# EAGLE design COMP (EAGLE 8.2.2)

## Sheet 1 of 3
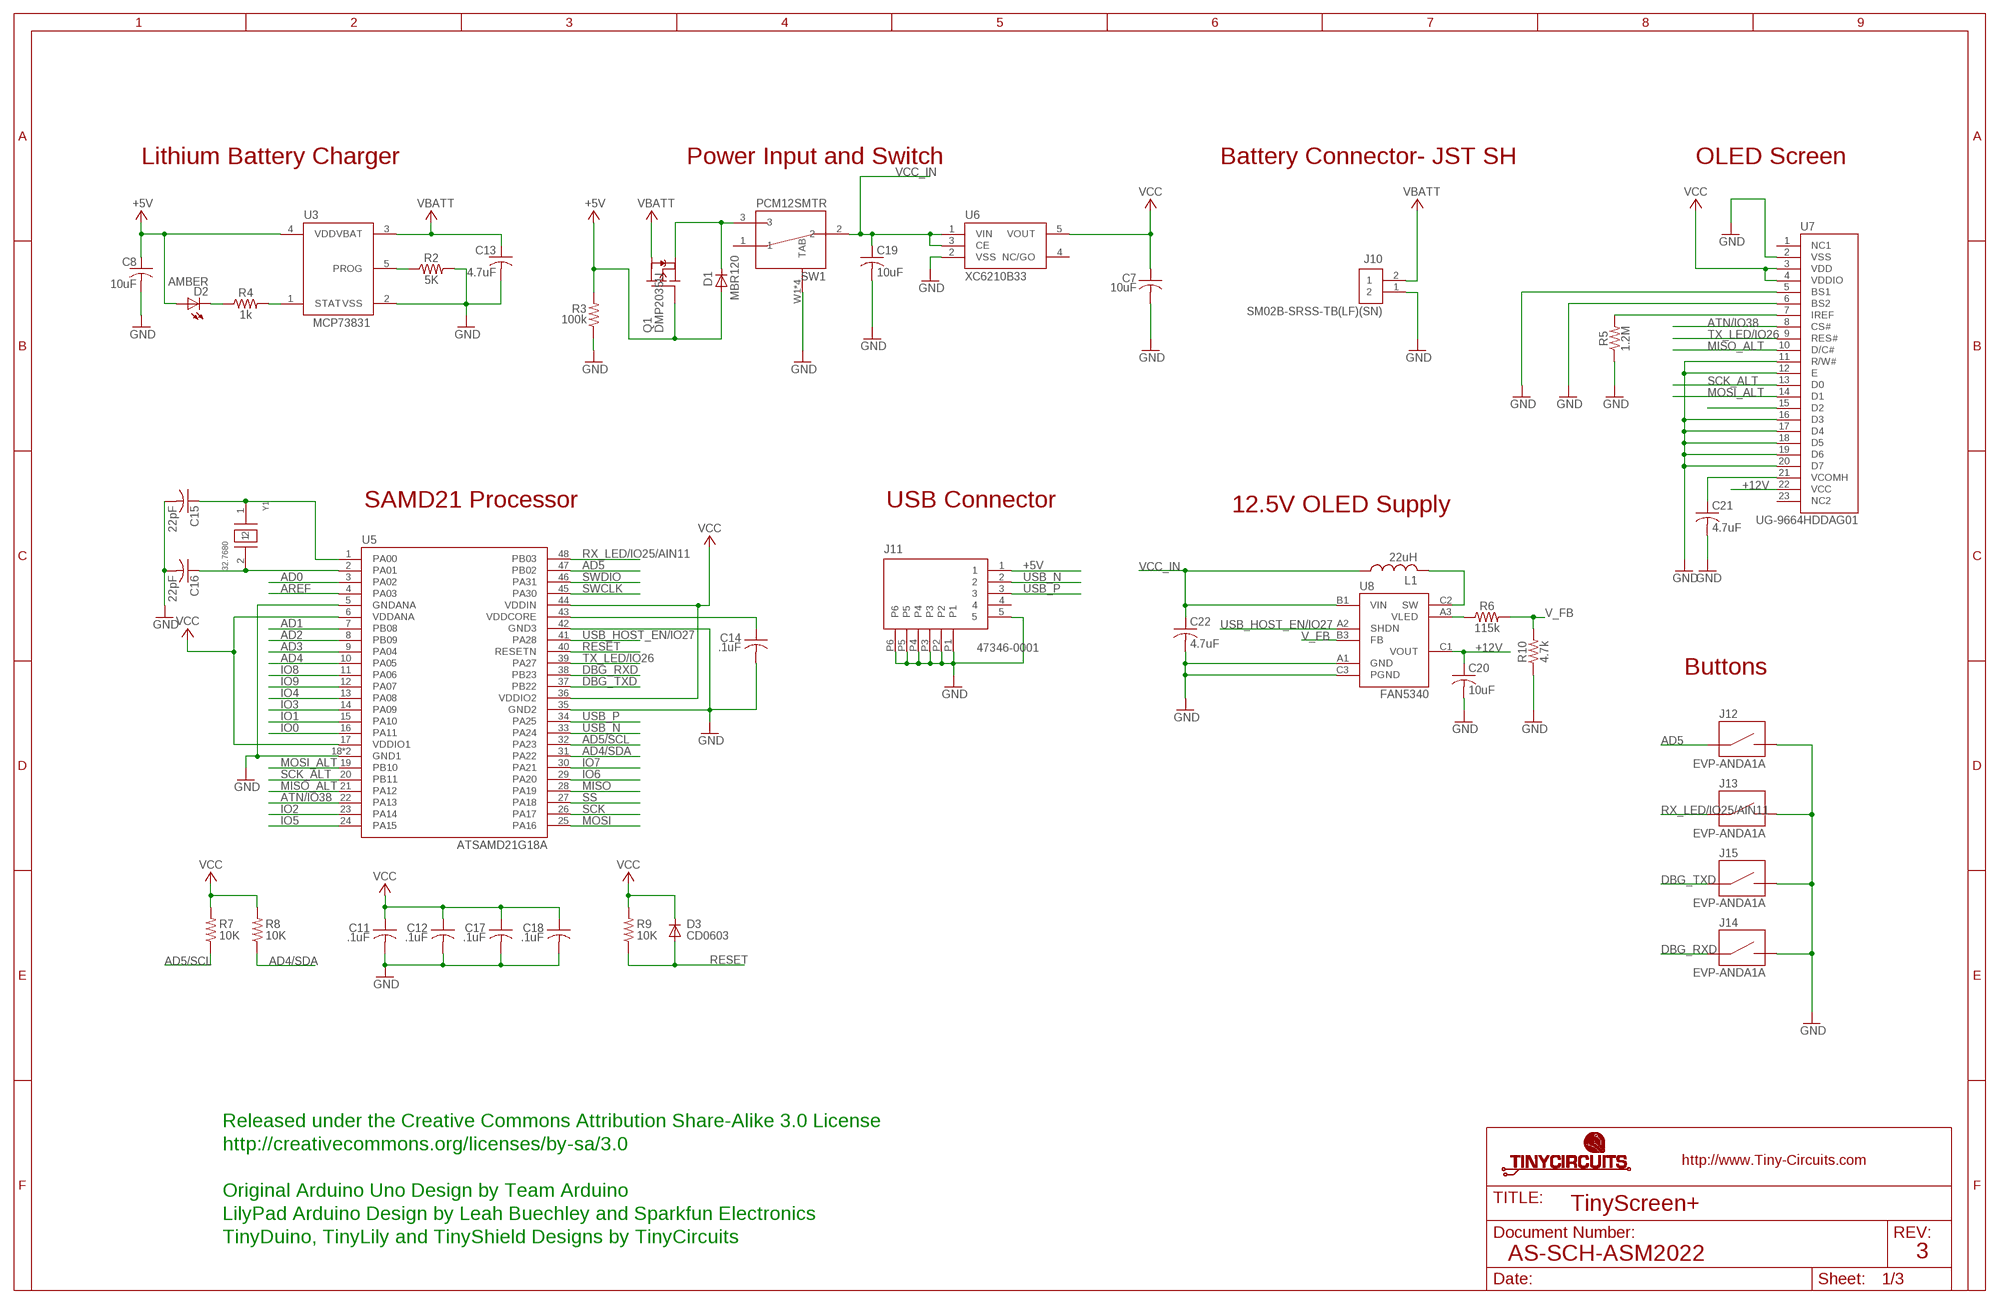
[diagram p0: schematic, sheet 1]

### Parts
C7  10uF  AS-ITM-00002  [C0603]
C8  10uF  AS-ITM-00002  [C0603]
C11  .1uF  AS-ITM-00008  [C0402]
C12  .1uF  AS-ITM-00008  [C0402]
C13  4.7uF  AS-ITM-00088  [C0603]
C14  .1uF  AS-ITM-00008  [C0402]
C15  22pF  AS-ITM-00211  [C0402]
C16  22pF  AS-ITM-00211  [C0402]
C17  .1uF  AS-ITM-00008  [C0402]
C18  .1uF  AS-ITM-00008  [C0402]
C19  10uF  AS-ITM-00045  [C0805]
C20  10uF  AS-ITM-00045  [C0805]
C21  4.7uF  AS-ITM-00232  [1206_CAP_TANT]
C22  4.7uF  AS-ITM-00242  [C0402]
D1  MBR120  AS-ITM-00111  [SOD-123FL]
D2  AMBER  AS-ITM-00026  [LNJ_LED]
D3  CD0603  AS-ITM-00009  [0603]
J10  SM02B-SRSS-TB(LF)(SN)  AS-ITM-00231  [JST_SH_2X1]
J11  47346-0001  AS-ITM-00021  [MICRO_USB]
J12  EVP-ANDA1A  AS-ITM-00236  [PTS840GKP]
J13  EVP-ANDA1A  AS-ITM-00236  [PTS840GKP]
J14  EVP-ANDA1A  AS-ITM-00236  [PTS840GKP]
J15  EVP-ANDA1A  AS-ITM-00236  [PTS840GKP]
L1  22uH  AS-ITM-00281  [R0805]
Q1  DMP2035U  AS-ITM-00024  [SOT23]
R2  5K  AS-ITM-00289  [0402]
R3  100k  AS-ITM-00004  [0402]
R4  1k  AS-ITM-00003  [0402]
R5  1.2M  AS-ITM-00280  [0402]
R6  115k  AS-ITM-00179  [0402]
R7  10K  AS-ITM-00032  [0402]
R8  10K  AS-ITM-00032  [0402]
R9  10K  AS-ITM-00032  [0402]
R10  4.7k  AS-ITM-00167  [0402]
SW1  PCM12SMTR  AS-ITM-00220  [PCM12SMTR]
U3  MCP73831  AS-ITM-00136  [SOT-23]
U5  ATSAMD21G18A  AS-ITM-00273  [QFN48]
U6  XC6210B33  AS-ITM-00046  [SOT-25]
U7  UG-9664HDDAG01  AS-ITM-00158  [OLED_DISPLAY]
U8  FAN5340  AS-ITM-00277  [WLCSP8_1_57X1_57]
Y1  32.7680  AS-ITM-00279  [ABS06]

### Nets
+5V: C8.1 D1.A D2.A J11.1 Q1.B(G) R3.2 U3.4(VDD)
+12V: C20.1 U7.22(VCC) U8.C1(VOUT)
AD0: U5.3(PA02)
AD1: U5.7(PB08)
AD2: U5.8(PB09)
AD3: U5.9(PA04)
AD4: U5.10(PA05)
AD4/SDA: R8.1 U5.31(PA22) ; also sheet 2
AD5: J12.1 J12.2 U5.47(PB02)
AD5/SCL: R7.1 U5.32(PA23) ; also sheet 2
AREF: U5.4(PA03)
ATN/IO38: U5.22(PA13) U7.8(CS#)
DBG_RXD: J14.1 J14.2 U5.38(PB23)
DBG_TXD: J15.1 J15.2 U5.37(PB22)
GND: C7.2 C8.2 C11.2 C12.2 C13.2 C14.2 C15.2 C16.2 C17.2 C18.2 C19.2 C20.2 C21.2 C22.2 J10.1 J11.5 J11.P1 J11.P2 J11.P3 J11.P4 J11.P5 J11.P6 J12.3 J12.4 J13.3 J13.4 J14.3 J14.4 J15.3 J15.4 R2.2 R3.1 R5.1 R10.1 SW1.W1(TAB) SW1.W2(TAB) SW1.W3(TAB) SW1.W4(TAB) U3.2(VSS) U5.5(GNDANA) U5.18(GND1) U5.35(GND2) U5.42(GND3) U5.EXP(GND1) U6.2(VSS) U7.2(VSS) U7.5(BS1) U7.6(BS2) U7.11(R/W#) U7.12(E) U7.16(D3) U7.17(D4) U7.18(D5) U7.19(D6) U7.20(D7) U8.A1(GND) U8.C3(PGND) ; also sheet 2
IO0: U5.16(PA11)
IO1: U5.15(PA10)
IO2: U5.23(PA14)
IO3: U5.14(PA09)
IO4: U5.13(PA08)
IO5: U5.24(PA15)
IO6: U5.29(PA20)
IO7: U5.30(PA21)
IO8: U5.11(PA06)
IO9: U5.12(PA07)
MISO: U5.28(PA19)
MISO_ALT: U5.21(PA12) U7.10(D/C#)
MOSI: U5.25(PA16)
MOSI_ALT: U5.19(PB10) U7.14(D1)
N$3: D1.C Q1.E(S) SW1.3
N$4: C15.1 U5.1(PA00) Y1.1
N$5: D2.C R4.1
N$6: R2.1 U3.5(PROG)
N$7: R4.2 U3.1(STAT)
N$8: C16.1 U5.2(PA01) Y1.2
N$9: C14.1 U5.43(VDDCORE)
N$10: L1.2 U8.C2(SW)
N$11: R5.2 U7.7(IREF)
N$12: C21.1 U7.21(VCOMH)
N$13: R6.1 U8.A3(VLED)
N$15: U7.15(D2)
RESET: D3.A R9.1 U5.40(RESETN)
RX_LED/IO25/AIN11: J13.1 J13.2 U5.48(PB03)
SCK: U5.26(PA17)
SCK_ALT: U5.20(PB11) U7.13(D0)
SS: U5.27(PA18)
SWCLK: U5.45(PA30)
SWDIO: U5.46(PA31)
TX_LED/IO26: U5.39(PA27) U7.9(RES#)
USB_HOST_EN/IO27: U5.41(PA28) U8.A2(SHDN)
USB_N: J11.2 U5.33(PA24)
USB_P: J11.3 U5.34(PA25)
V_FB: R6.2 R10.2 U8.B3(FB)
VBATT: C13.1 J10.2 Q1.C(D) U3.3(VBAT)
VCC: C7.1 C11.1 C12.1 C17.1 C18.1 D3.C R7.2 R8.2 R9.2 U5.6(VDDANA) U5.17(VDDIO1) U5.36(VDDIO2) U5.44(VDDIN) U6.5(VOUT) U7.3(VDD) U7.4(VDDIO) ; also sheet 2
VCC_IN: C19.1 C22.1 L1.1 SW1.2 U6.1(VIN) U6.3(CE) U8.B1(VIN)
Unconnected: J11.4 SW1.1 U6.4(NC/GO) U7.1(NC1) U7.23(NC2)

### Notes on the sheet
- Lithium Battery Charger | Power Input and Switch | Battery Connector- JST SH | OLED Screen
- SAMD21 Processor | USB Connector | 12.5V OLED Supply
- Buttons
- Released under the Creative Commons Attribution Share-Alike 3.0 License
- http://creativecommons.org/licenses/by-sa/3.0
- Original Arduino Uno Design by Team Arduino
- TinyScreen+
- LilyPad Arduino Design by Leah Buechley and Sparkfun Electronics
- TinyDuino, TinyLily and TinyShield Designs by TinyCircuits
- AS-SCH-ASM2022 | 3

## Sheet 2 of 3
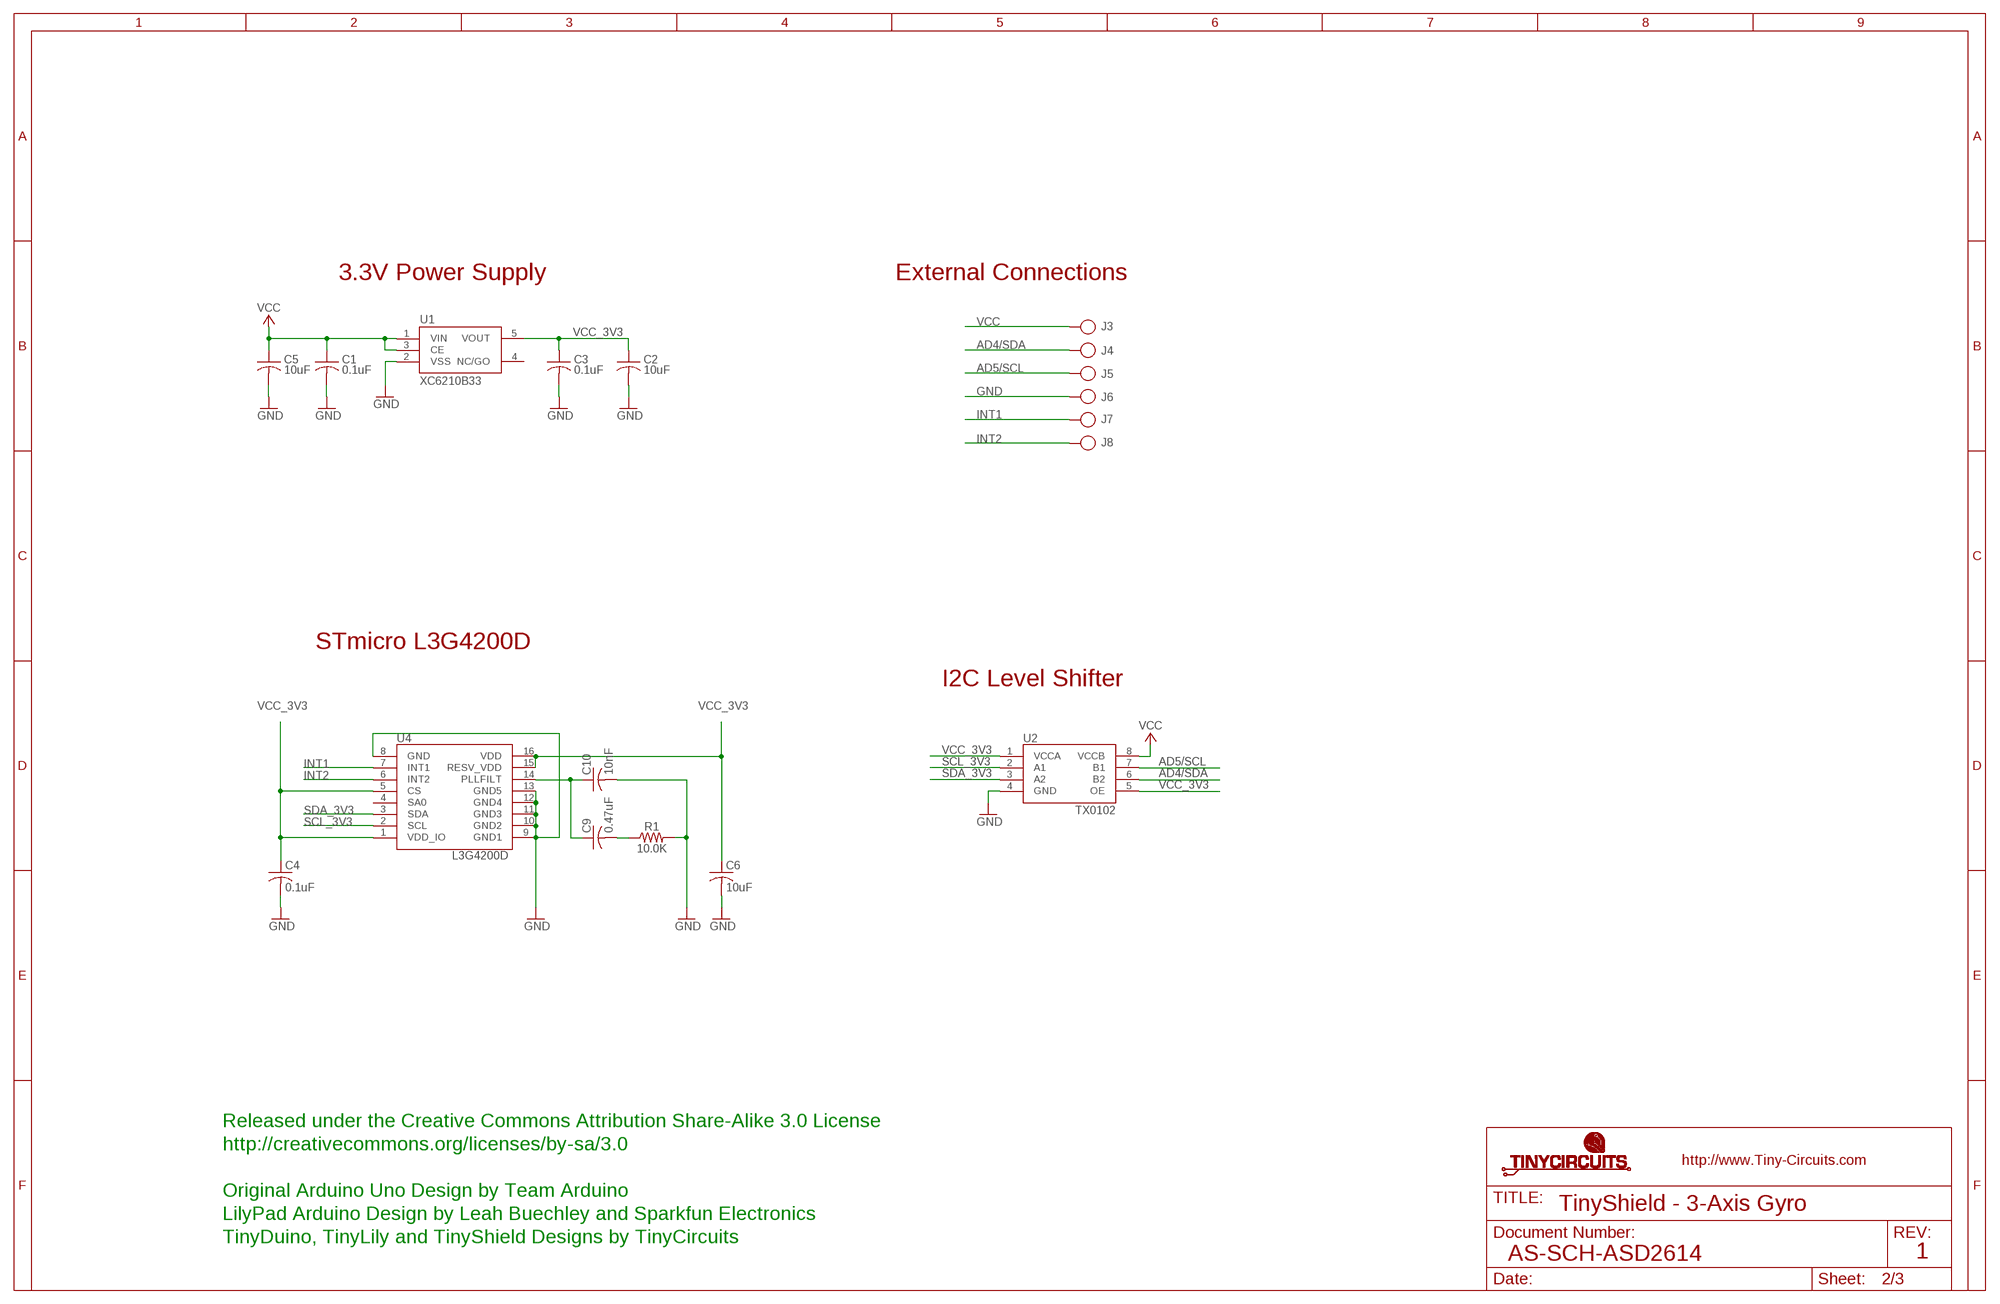
[diagram p1: schematic, sheet 2]

### Parts
C1  0.1uF  AS-ITM-00008  [C0402]
C2  10uF  AS-ITM-00045  [C0805]
C3  0.1uF  AS-ITM-00008  [C0402]
C4  0.1uF  AS-ITM-00008  [C0402]
C5  10uF  AS-ITM-00045  [C0805]
C6  10uF  AS-ITM-00002  [C0603]
C9  0.47uF  AS-ITM-00090  [C0402@1]
C10  10nF  AS-ITM-00084  [0402@1]
J3  PIN_1X.1"  [1X.1"]
J4  PIN_1X.1"  [1X.1"]
J5  PIN_1X.1"  [1X.1"]
J6  PIN_1X.1"  [1X.1"]
J7  PIN_1X.1"  [1X.1"]
J8  PIN_1X.1"  [1X.1"]
R1  10.0K  AS-ITM-00032  [0402]
U1  XC6210B33  AS-ITM-00046  [SOT-25]
U2  TX0102  AS-ITM-00073  [DQE(R-PX2SON-N8)]
U4  L3G4200D  AS-ITM-00089  [L3G4200D]

### Nets
AD4/SDA: J4.1 U2.6(B2) ; also sheet 1
AD5/SCL: J5.1 U2.7(B1) ; also sheet 1
GND: C1.2 C2.2 C3.2 C4.2 C5.2 C6.2 C10.2 J6.1 R1.2 U1.2(VSS) U2.4(GND) U4.8(GND) U4.9(GND1) U4.10(GND2) U4.11(GND3) U4.12(GND4) U4.13(GND5) ; also sheet 1
INT1: J7.1 U4.7(INT1)
INT2: J8.1 U4.6(INT2)
N$1: C9.2 R1.1
N$2: C9.1 C10.1 U4.14(PLLFILT)
SCL_3V3: U2.2(A1) U4.2(SCL)
SDA_3V3: U2.3(A2) U4.3(SDA)
VCC: C1.1 C5.1 J3.1 U1.1(VIN) U1.3(CE) U2.8(VCCB) ; also sheet 1
VCC_3V3: C2.1 C3.1 C4.1 C6.1 U1.5(VOUT) U2.1(VCCA) U2.5(OE) U4.1(VDD_IO) U4.5(CS) U4.15(RESV_VDD) U4.16(VDD)
Unconnected: U1.4(NC/GO) U4.4(SA0)

### Notes on the sheet
- 3.3V Power Supply | External Connections
- STmicro L3G4200D
- I2C Level Shifter
- Released under the Creative Commons Attribution Share-Alike 3.0 License
- http://creativecommons.org/licenses/by-sa/3.0
- Original Arduino Uno Design by Team Arduino
- TinyShield - 3-Axis Gyro
- LilyPad Arduino Design by Leah Buechley and Sparkfun Electronics
- TinyDuino, TinyLily and TinyShield Designs by TinyCircuits
- AS-SCH-ASD2614 | 1

## Sheet 3 of 3

## Library data of the parts
C1 C3 C4 = tinycircuits:AS-ITM-00008: CAP CER 0.1UF 16V 10% X5R 0402; MPN: GRM155R61A104JA01D; OC_NEWARK: 03AC2559; PARTNO: AS-ITM-00008
C2 C5 C19 C20 = tinycircuits:AS-ITM-00045: CAP CER 16UF 16V 20% X5R 0805; MF: Taiyo Yuden (U.S.A.), Inc.; MPN: LMK212BJ106KG-T; OC_NEWARK: 18J2720; PARTNO: AS-ITM-00045
C6-C8 = tinycircuits:AS-ITM-00002: CAP CER 10UF 10V 20% X5R 0603; MPN: C0603X5R1A104K030BC; OC_NEWARK: 04X3188; PARTNO: AS-ITM-00002
C9 = tinycircuits:AS-ITM-00090: CAP CER 0.47UF 6.3V 20% X5R 0402; MPN: GRM155R60J474KE19D; OC_NEWARK: 03AC2556
C10 = tinycircuits:AS-ITM-00084: CAP CER 10NF25V10% X7R 0402; MF: BC COMPONENTS; MPN: VJ0402V103ZXACW1BC; OC_NEWARK: 57J7497; PARTNO: AS-ITM-00084; VALUE: C1005X7R1E103K050BB
C11 C12 C14 C17 C18 = tinycircuits:AS-ITM-00008: CAP CER 0.1UF 16V 10% X5R 0402; MPN: GRM155R61C104KA88D; OC_NEWARK: 03AC2568; PARTNO: AS-ITM-00008; VALUE: 0.1uF
C13 = tinycircuits:AS-ITM-00088: CAP CER 4.7UF 6.3V 20% X5R 0603; MPN: C0603X5R0J474K030BC; OC_NEWARK: 78Y9870; PARTNO: AS-ITM-00088
C15 C16 = tinycircuits:AS-ITM-00211: CAP CER 22PF 50V 2% NP0 0402; MF: KEMET; MPN: C0402C220C5GACTU; OC_NEWARK: 01E9918; PARTNO: AS-ITM-00211
C21 = tinycircuits:AS-ITM-00232: CAP TANT 4.7UF 20V 20% 1206; MPN: TAJA475K020RNJ; OC_NEWARK: 60R5858; PARTNO: AS-ITM-00232; VALUE: F931D475MAA
C22 = tinycircuits:AS-ITM-00242: CAP CER 4.7UF 6.3V 20% X5R 0402; MPN: C0402C475M9PACTU; OC_NEWARK: 23AC3655; PARTNO: AS-ITM-00242
D1 = tinycircuits:AS-ITM-00111: DIODE SCHOTTKY 20V 1A SOD123L; MPN: MBR120LSFT1G; OC_NEWARK: 10N9423; PARTNO: AS-ITM-00111; VALUE: MBR120VLSFT1G
D2 = tinycircuits:AS-ITM-00026: LED AMBER SIDE VIEW SMD; MPN: LNJ426W83RA1; OC_NEWARK: 43W4882; PARTNO: AS-ITM-00026
D3 = tinycircuits:AS-ITM-00009: Diodes (General Purpose, Power, Switching) IO=150mA VR=75V HIGH SPEED; MF: BOURNS, INC.; MPN: CD0603-S01575; OC_NEWARK: 02J1227; PARTNO: AS-ITM-00009
J3-J8 = tinycircuits:PIN_1X.1": 1 Pin 0.100" Header; OC_NEWARK: unknown
J10 = tinycircuits:AS-ITM-00231: CONN HEADER SH 2POS SIDE 1MM; MPN: SM02B-SRSS-TB (LF)(SN); OC_NEWARK: 33P8179; PARTNO: AS-ITM-00231
J11 = tinycircuits:AS-ITM-00021: CONN RCPT 5POS MICRO USB R/A; MPN: 47346-0001; OC_NEWARK: 47M0505; PARTNO: AS-ITM-00021
J12-J15 = tinycircuits:AS-ITM-00236: SWITCH TACTILE SPST-NO 0.05A 12V; MPN: EVP-ANDA1A; OC_NEWARK: 52W2464; PARTNO: AS-ITM-00236; VALUE: PTS840 GKP
L1 = tinycircuits:AS-ITM-00281: FIXED IND 22UH 300MA 670 MOHM; OC_NEWARK: unknown; PARTNO: AS-ITM-00281
Q1 = tinycircuits:AS-ITM-00024: P-Channel MOSFET SOT-23; MPN: DMP2035U; OC_NEWARK: 65T8230; PARTNO: AS-ITM-00024
R1 = tinycircuits:AS-ITM-00032: RES 10.0K OHM 1/16W 1% 0402 SMD; MF: VISHAY/DALE; MPN: CRCW120610K0FKTA; OC_NEWARK: 05F1568; PARTNO: AS-ITM-00032
R2 = tinycircuits:AS-ITM-00289: RES SMD 5.0K OHM 1% 1/16W 0402; OC_NEWARK: unknown; PARTNO: AS-ITM-00289
R3 = tinycircuits:AS-ITM-00004: RES 100K OHM 1/16W 1% 0402; MPN: CRG0402J100K/10; OC_NEWARK: 20R1174; PARTNO: AS-ITM-00004; VALUE: 100K
R4 = tinycircuits:AS-ITM-00003: RES 1.00K OHM 1/16W 1% 0402; MF: VISHAY/DALE; MPN: CRCW04021K00FKTD; OC_NEWARK: 07J7497; PARTNO: AS-ITM-00003; VALUE: 1.00K
R5 = tinycircuits:AS-ITM-00280: RES SMD 1.2M OHM 1% 1/16W 0402; OC_NEWARK: unknown; PARTNO: AS-ITM-00280
R6 = tinycircuits:AS-ITM-00179: RES 115K OHM 1/16W 1% SMD 0402; MPN: CPF0402B115KE1; OC_NEWARK: 05AC7931; PARTNO: AS-ITM-00179; VALUE: 115K
R7-R9 = tinycircuits:AS-ITM-00032: RES 10.0K OHM 1/16W 1% 0402 SMD; MPN: TNPW040210K0BEED; OC_NEWARK: 11R2753; PARTNO: AS-ITM-00032; VALUE: 10.0K
R10 = tinycircuits:AS-ITM-00167: RES 4.7K OHM 1/16W 5% 0402 SMD; MPN: 373-4.7K; OC_NEWARK: 82T4833; PARTNO: AS-ITM-00167; VALUE: 4.7K
SW1 = tinycircuits:AS-ITM-00220: SW SLIDE SP2T 6VDC 0.3A SMT; OC_NEWARK: unknown; PARTNO: AS-ITM-00220
U1 U6 = tinycircuits:AS-ITM-00046: IC REG LDO 3.3V .7A SOT-25; OC_NEWARK: unknown; PARTNO: AS-ITM-00046
U2 = tinycircuits:AS-ITM-00073: TI 2-Bit Bidirectional Voltage-Level Translator; OC_NEWARK: unknown; PARTNO: AS-ITM-00073; VALUE: TXS0102
U3 = tinycircuits:AS-ITM-00136: IC CONTROLLER LI-ION 4.2V SOT23-5; OC_NEWARK: unknown; PARTNO: AS-ITM-00136
U4 = tinycircuits:AS-ITM-00089: Gyroscopes Mems Sensor 3-Axis 2.4 to 3.6 V Gyro; OC_NEWARK: unknown; PARTNO: AS-ITM-00089
U5 = tinycircuits:AS-ITM-00273: IC MCU 32BIT 256KB FLASH 48QFN; OC_NEWARK: unknown; PARTNO: AS-ITM-00273
U7 = tinycircuits:AS-ITM-00158: 0.96" OLED Display; OC_NEWARK: unknown; PARTNO: AS-ITM-00158
U8 = tinycircuits:AS-ITM-00277: IC LED BOOST DC DC BACKLIGHT 8-WLCSP; OC_NEWARK: unknown; PARTNO: AS-ITM-00277
Y1 = tinycircuits:AS-ITM-00279: Crystal 32.7680kHz 20ppm 12.5pF; OC_NEWARK: unknown; PARTNO: AS-ITM-00279

## Board
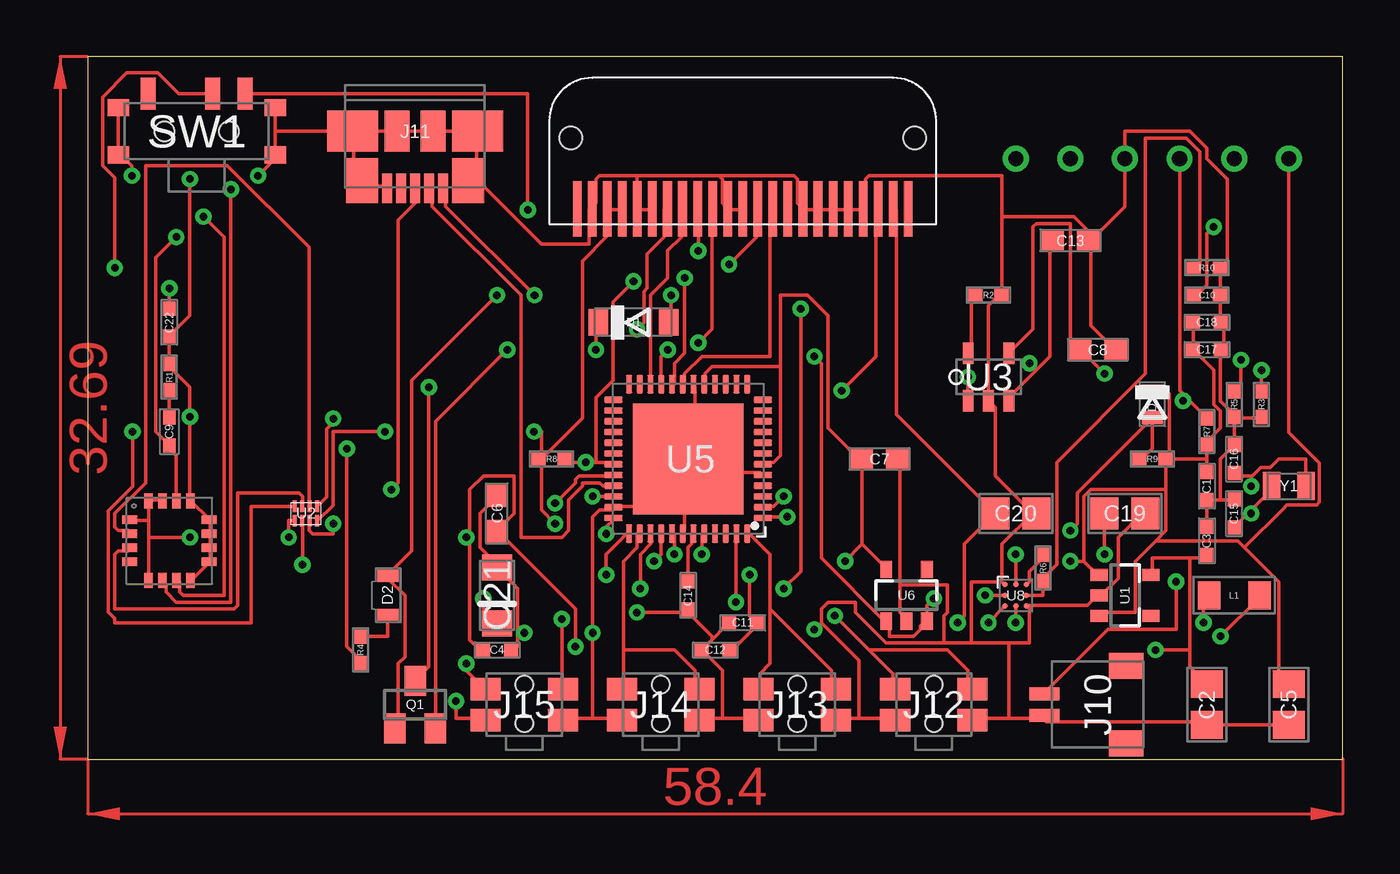
[diagram p2: board, top side]
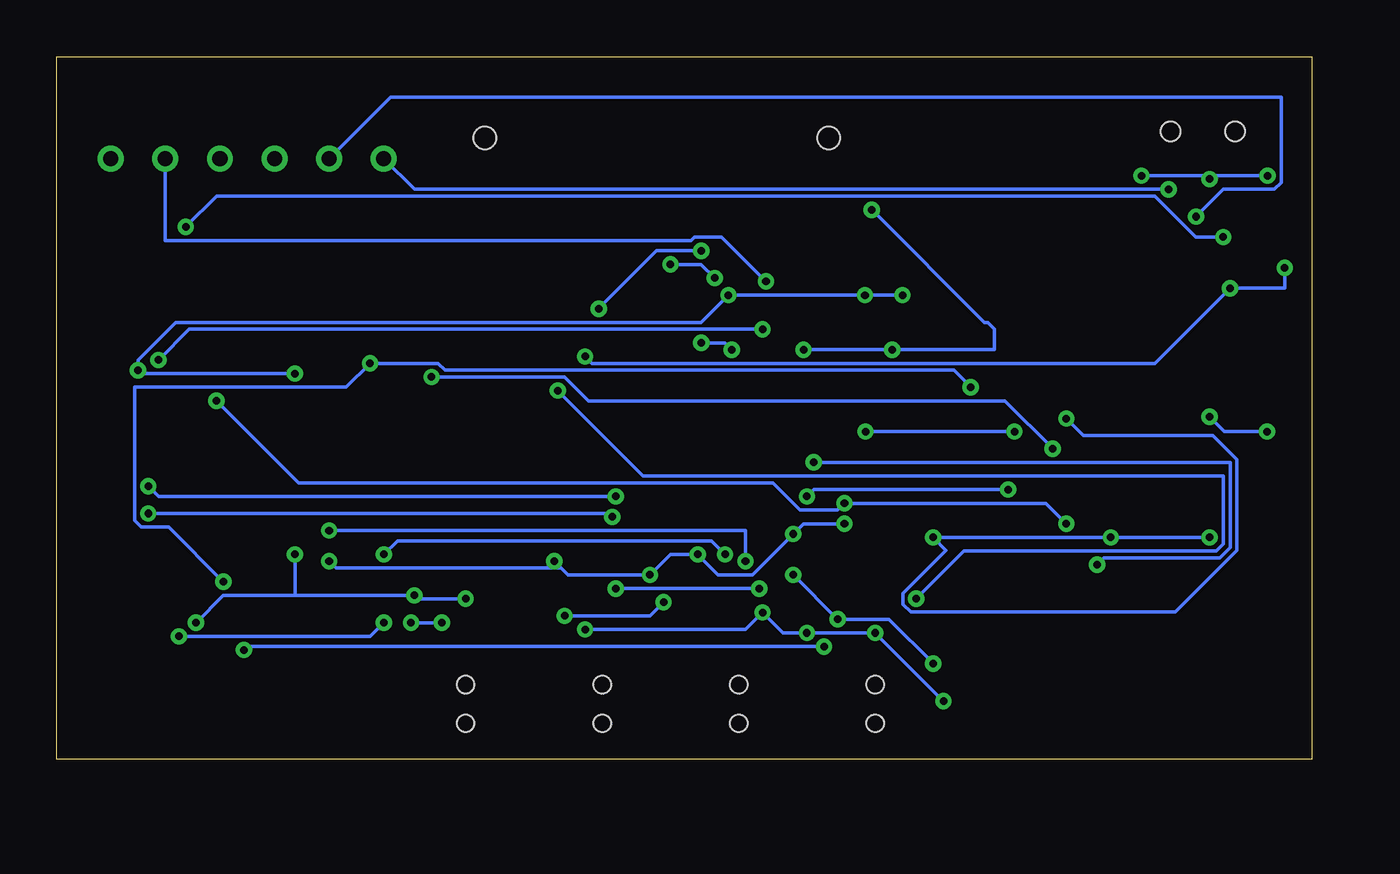
[diagram p3: board, bottom side, seen from below]

Size 58.4 x 32.69 mm. Coordinates in mm from the lower left corner, seen from the top.
Outline: 0,0 58.4,0 58.4,32.69 0,32.69 0,0
Copper layers (1*16): Top 0.035mm / dielectric 1.5mm / Bottom 0.035mm
Design rules "default": minimum track width 6mil, minimum drill 0.35mm, track to track 6mil, track to pad 6mil, pad to pad 6mil, via to via 6mil, smd to smd 6mil, copper to edge 40mil, drill to drill 6mil, minimum pad ring 10mil, minimum via ring 8mil, stop-mask expansion 4mil, vias tented up to drill 0mil, thermal gap 10mil

### Footprints (pad centres in the part's own frame; a part is rotated, then mirrored left to right if it is on the bottom)
C0402 = smd 0.65 x 0.6: 1 -0.65,0; 2 0.65,0
C0805 = smd 1.3 x 1.5: 1 -0.95,0; 2 0.95,0
C0603 = smd 1.1 x 1: 1 -0.85,0; 2 0.85,0
C0402@1 = smd 0.65 x 0.6: 1 -0.65,0; 2 0.65,0
0402@1 = smd 0.65 x 0.55: 1 -0.6,0; 2 0.6,0
1206_CAP_TANT = smd 1.2 x 1.4: 1 -1.3,0; 2 1.3,0
SOD-123FL = smd 0.914 x 1.219: A 1.638,0; C -1.638,0
LNJ_LED = smd 1 x 0.55: A 0,0.9; C 0,-0.9
0603 = smd 0.61 x 0.991: A 0.622,0; C -0.622,0
1X.1" = drill 0.7 pad 1.016: 1 0,0
JST_SH_2X1 = smd 0.6 x 1.4: 1 -0.5,2.475; 2 0.5,2.475 | smd 1.2 x 1.6: PAD1 -1.8,-1.325; PAD2 1.8,-1.325
MICRO_USB = smd 1.38 x 0.45: 1 2.66,1.3; 2 2.66,0.65; 3 2.66,0; 4 2.66,-0.65; 5 2.66,-1.3 | smd 2.1 x 1.475: P1 2.3,-2.462; P2 2.3,2.462 | smd 1.9 x 2.375: P3 0,2.913; P4 0,-2.913 | smd 1.9 x 1.175: P5 0,0.838; P6 0,-0.838
PTS840GKP = smd 1.4 x 1.05: 1 -1.8,0.725; 2 1.8,0.725; 3 -1.8,-0.725; 4 1.8,-0.725 | hole 0.8: 0,0.925; 0,-0.875
R0805 = smd 1.05 x 1.3: 1 -1.175,0; 2 1.175,0
SOT23 = smd 1 x 1.4: B -0.95,-1.1; C 0,1.1; E 0.95,-1.1
0402 = smd 0.65 x 0.55: 1 -0.6,0; 2 0.6,0
PCM12SMTR = smd 0.7 x 1.5: 1 -2.25,1.75; 2 0.75,1.75; 3 2.25,1.75 | smd 1 x 0.8: W1 -3.65,1.1; W2 -3.65,-1.1; W3 3.65,-1.1; W4 3.65,1.1 | hole 0.9: 1.5,0; -1.5,0
SOT-25 = smd 0.55 x 0.8: 1 -0.95,-1.2; 2 0,-1.2; 3 0.95,-1.2; 4 0.95,1.2; 5 -0.95,1.2
DQE(R-PX2SON-N8) = smd 0.2 x 0.53: 1 -0.525,-0.335; 2 -0.175,-0.335; 3 0.175,-0.335; 4 0.525,-0.335; 5 0.525,0.335; 6 0.175,0.335; 7 -0.175,0.335; 8 -0.525,0.335
SOT-23 = smd 0.5 x 1: 1 -0.95,-1.1; 2 0,-1.1; 3 0.95,-1.1; 4 0.95,1.1; 5 -0.95,1.1
L3G4200D = smd 0.7 x 0.4: 1 -1.85,0.975; 2 -1.85,0.325; 3 -1.85,-0.325; 4 -1.85,-0.975; 9 1.85,-0.975; 10 1.85,-0.325; 11 1.85,0.325; 12 1.85,0.975 | smd 0.4 x 0.7: 5 -0.975,-1.85; 6 -0.325,-1.85; 7 0.325,-1.85; 8 0.975,-1.85; 13 0.975,1.85; 14 0.325,1.85; 15 -0.325,1.85; 16 -0.975,1.85
QFN48 = smd 0.85 x 0.28: 1 -3.475,2.75; 2 -3.475,2.25; 3 -3.475,1.75; 4 -3.475,1.25; 5 -3.475,0.75; 6 -3.475,0.25; 7 -3.475,-0.25; 8 -3.475,-0.75; 9 -3.475,-1.25; 10 -3.475,-1.75; 11 -3.475,-2.25; 12 -3.475,-2.75; 25 3.475,-2.75; 26 3.475,-2.25; 27 3.475,-1.75; 28 3.475,-1.25; 29 3.475,-0.75; 30 3.475,-0.25; 31 3.475,0.25; 32 3.475,0.75; 33 3.475,1.25; 34 3.475,1.75; 35 3.475,2.25; 36 3.475,2.75 | smd 0.28 x 0.85: 13 -2.75,-3.475; 14 -2.25,-3.475; 15 -1.75,-3.475; 16 -1.25,-3.475; 17 -0.75,-3.475; 18 -0.25,-3.475; 19 0.25,-3.475; 20 0.75,-3.475; 21 1.25,-3.475; 22 1.75,-3.475; 23 2.25,-3.475; 24 2.75,-3.475; 37 2.75,3.475; 38 2.25,3.475; 39 1.75,3.475; 40 1.25,3.475; 41 0.75,3.475; 42 0.25,3.475; 43 -0.25,3.475; 44 -0.75,3.475; 45 -1.25,3.475; 46 -1.75,3.475; 47 -2.25,3.475; 48 -2.75,3.475 | smd 5.15 x 5.15: EXP 0,0
OLED_DISPLAY = smd 0.4 x 2.6: 1 -7.7,0.2; 2 -7,0.2; 3 -6.3,0.2; 4 -5.6,0.2; 5 -4.9,0.2; 6 -4.2,0.2; 7 -3.5,0.2; 8 -2.8,0.2; 9 -2.1,0.2; 10 -1.4,0.2; 11 -0.7,0.2; 12 0,0.2; 13 0.7,0.2; 14 1.4,0.2; 15 2.1,0.2; 16 2.8,0.2; 17 3.5,0.2; 18 4.2,0.2; 19 4.9,0.2; 20 5.6,0.2; 21 6.3,0.2; 22 7,0.2; 23 7.7,0.2 | hole 1.05: 8,3.5; -8,3.5
WLCSP8_1_57X1_57 = smd 0.25 x 0.25: A1 -0.5,0.5; A2 0,0.5; A3 0.5,0.5; B1 -0.5,0; B3 0.5,0; C1 -0.5,-0.5; C2 0,-0.5; C3 0.5,-0.5
ABS06 = smd 0.8 x 1.3: 1 -0.8,0; 2 0.8,0

### Placement (x,y rotation side)
C1  52.07,12.7 270 top
C2  52.07,2.54 270 top
C3  52.07,10.16 90 top
C4  19.05,5.08 0 top
C5  55.88,2.54 270 top
C6  19.05,11.43 90 top
C7  36.83,13.97 0 top
C8  46.99,19.05 0 top
C9  3.81,15.24 90 top
C10  52.07,21.59 0 top
C11  30.48,6.35 180 top
C12  29.21,5.08 180 top
C13  45.72,24.13 0 top
C14  27.94,7.62 270 top
C15  53.34,11.43 90 top
C16  53.34,13.97 90 top
C17  52.07,19.05 0 top
C18  52.07,20.32 0 top
C19  48.26,11.43 0 top
C20  43.18,11.43 0 top
C21  19.05,7.62 90 top
C22  3.81,20.32 270 top
D1  25.4,20.32 0 top
D2  13.97,7.62 0 top
D3  49.53,16.51 270 top
J3  55.88,27.94 0 top
J4  53.34,27.94 0 top
J5  50.8,27.94 0 top
J6  48.26,27.94 0 top
J7  45.72,27.94 0 top
J8  43.18,27.94 0 top
J10  46.99,2.54 90 top
J11  15.24,29.21 270 top
J12  39.37,2.54 0 top
J13  33.02,2.54 0 top
J14  26.67,2.54 0 top
J15  20.32,2.54 0 top
L1  53.34,7.62 0 top
Q1  15.24,2.54 0 top
R1  3.81,17.78 90 top
R2  41.91,21.59 0 top
R3  54.61,16.51 90 top
R4  12.7,5.08 270 top
R5  53.34,16.51 90 top
R6  44.45,8.89 270 top
R7  52.07,15.24 270 top
R8  21.59,13.97 180 top
R9  49.53,13.97 0 top
R10  52.07,22.86 180 top
SW1  5.08,29.21 0 top
U1  48.26,7.62 270 top
U2  10.16,11.43 180 top
U3  41.91,17.78 0 top
U4  3.81,10.16 0 top
U5  27.94,13.97 180 top
U6  38.1,7.62 0 top
U7  30.48,25.4 0 top
U8  43.18,7.62 0 top
Y1  55.88,12.7 0 top

### Tracks (layer width: path | path; a pad name or v marks a point on that pad's centre or on a via)
+5V  (via drill 0.35)
  Top 0.152: Q1.B 14.45,1.59 14.45,4.45 14.76,4.76 14.76,7.62 13.97,8.41 D2.A 13.97,8.57 15.08,9.68 15.08,17.62 v19.05,21.59 | v54.61,18.1 R3.2 | v47.31,17.94 46.2,19.05 C8.1 46.04,19.05 45.72,19.37 45.72,24.92 44.13,24.92 43.97,24.77 43.97,20 42.86,18.89 U3.4 | v27.15,21.59 27.15,20.32 D1.A | v20.8,21.59 16.67,25.72 16.67,26.51 J11.1
  Bottom 0.152: v47.31,17.94 54.45,17.94 v54.61,18.1 54.61,18.57 52.86,20.32 28.42,20.32 v27.15,21.59 v20.8,21.59 v19.05,21.59
+12V  (via drill 0.35)
  Top 0.152: v41.91,6.35 U8.C1 42.7,7.14 | v40.48,6.35 40.8,6.67 40.8,10 C20.1 | C20.1 37.62,16.03 37.62,25.56 U7.22 | C20.1
  Bottom 0.152: v40.48,6.35 v41.91,6.35
AD4/SDA  (via drill 0.35)
  Top 0.152: v10,9.05 10,10.95 U2.6 | R8.1 22.23,13.97 22.23,13.81 v23.18,13.81 23.65,13.81 | 23.65,13.81 24.45,13.81 U5.31 | v25.4,22.23 24.45,21.27 24.45,17.62 23.65,16.83 23.65,13.81
  Bottom 0.152: v10,9.05 9.68,9.37 4.29,9.37 3.81,9.84 3.81,13.81 v23.18,13.81 | J4.1 53.34,24.13 28.89,24.13 28.73,24.29 27.46,24.29 v25.4,22.23
AD5  (via drill 0.35)
  Top 0.152: v30.16,7.3 30.16,10.48 U5.47 | 36.35,5.08 37.47,3.97 37.47,3.33 J12.1 | 36.35,5.08 v34.77,6.67 | 36.35,5.08 40,5.08 40.96,4.13 40.96,3.49 41.12,3.33 J12.2
  Bottom 0.152: v30.16,7.3 30.8,6.67 v34.77,6.67
AD5/SCL  (via drill 0.35)
  Top 0.152: 51.12,16.83 50.8,17.14 J5.1 | 51.12,16.83 52.07,15.88 R7.1 | v11.43,10.95 11.43,10.48 10.48,10.48 10.32,10.64 10.32,10.95 U2.7 | v21.75,11.91 22.7,12.86 22.7,13.02 22.86,13.18 24.45,13.18 U5.32 | v50.96,16.67 51.12,16.83
  Bottom 0.152: v11.43,10.95 12.38,11.91 v21.75,11.91 22.07,11.59 23.81,11.59 25.08,12.86 47.15,12.86 v50.96,16.67
ATN/IO38
  Top 0.152: U5.22 26.19,17.46 26.19,21.59 26.99,22.38 26.99,23.65 27.62,24.29 27.62,25.56 U7.8
DBG_RXD
  Top 0.152: 24.92,5.08 24.92,3.33 J14.1 | 24.92,5.08 24.92,9.21 25.56,9.84 25.56,10.48 U5.38 | 24.92,5.08 27.31,5.08 28.26,4.13 28.26,3.49 28.42,3.33 J14.2
DBG_TXD  (via drill 0.35)
  Top 0.152: v24.13,8.57 24.13,9.53 25.08,10.48 U5.37 | v22.07,6.51 22.07,3.33 J15.2 | v17.62,4.45 17.62,4.13 18.41,3.33 J15.1
  Bottom 0.152: v24.13,8.57 v22.07,6.51 19.69,6.51 v17.62,4.45
GND  (via drill 0.35)
  Top 0.152: U4.8 4.92,8.41 5.56,9.05 U4.9 5.72,9.21 5.72,9.68 U4.10 5.72,9.84 5.72,10.48 U4.11 5.72,10.64 5.72,11.11 U4.12 5.56,11.27 4.92,11.91 U4.13 4.76,12.06 v4.76,15.93 4.76,17.3 3.81,18.26 R1.2 C22.2 3.81,19.69 4.76,20.64 v4.76,26.99 | SW1.W1 1.43,30.16 1.43,28.26 SW1.W2 1.59,28.1 2.06,27.62 v2.06,27.15 | 8.73,29.21 8.73,30.16 SW1.W4 | 8.73,29.21 8.73,28.26 SW1.W3 8.57,28.1 8.57,27.78 v7.94,27.15 | 17.94,27.15 18.1,27.31 18.1,29.21 | 17.94,27.15 J11.P2 17.78,26.99 | J11.5 13.81,26.67 12.86,26.67 12.86,26.83 J11.P1 12.38,27.31 12.38,29.21 | 12.38,29.21 J11.P6 J11.P5 18.1,29.21 | 12.38,29.21 J11.P4 8.73,29.21 | 18.1,29.21 J11.P3 | 29.05,5.56 29.69,6.19 29.69,6.35 C11.2 | 29.05,5.56 28.58,5.08 | 27.94,6.83 29.05,5.72 29.05,5.56 | 29.53,1.91 31.11,1.91 J13.3 | 29.53,1.91 28.58,1.91 J14.4 | 28.58,5.08 29.53,4.13 29.53,1.91 | 28.58,5.08 C12.2 | 20,5.87 20,7.94 19.05,8.89 C21.2 19.05,9.05 18.26,9.84 18.26,11.43 19.05,12.22 C6.2 | 20,5.87 20,5.24 19.84,5.08 C4.2 | v17.15,2.7 17.15,1.91 18.41,1.91 J15.3 | 20,5.87 v20.32,5.87 | v25.56,6.83 27.94,6.83 | 27.94,6.83 C14.2 | 23.5,1.91 24.77,1.91 J14.3 | 23.5,1.91 22.23,1.91 J15.4 | 27.78,11.75 27.78,13.81 U5.EXP | 27.78,11.75 27.78,10.64 U5.42 | 27.78,11.75 24.61,11.75 U5.35 24.45,11.59 23.81,11.59 23.5,11.27 v23.5,5.87 23.5,1.91 | 27.78,11.75 U5.EXP | 28.26,13.34 27.94,13.34 U5.EXP | 28.26,13.34 31.27,13.34 U5.5 | 28.26,13.34 28.26,17.3 U5.18 | 28.26,13.34 U5.EXP | U7.12 30.48,25.56 29.84,25.56 U7.11 29.69,25.72 29.53,25.88 29.53,26.99 29.37,27.15 | 25.56,27.15 23.81,27.15 23.65,26.99 23.65,25.88 23.5,25.72 U7.2 23.34,25.56 23.34,23.97 21.11,23.97 17.94,27.15
  Top 0.152: 25.56,27.15 25.56,25.72 U7.5 25.72,25.56 26.19,25.56 U7.6 | 25.56,27.15 29.37,27.15 | 29.37,27.15 32.86,27.15 33.02,26.99 33.02,25.88 33.18,25.72 U7.16 33.34,25.56 33.97,25.56 U7.17 34.13,25.56 34.61,25.56 U7.18 34.77,25.56 35.24,25.56 U7.19 35.4,25.56 36.04,25.56 U7.20 36.2,25.72 36.2,26.99 36.35,27.15 42.55,27.15 42.55,25.24 | 52.7,22.86 52.7,21.59 | 52.7,21.59 52.7,20.32 C18.2 52.86,20.32 52.86,19.05 C17.2 52.7,19.05 52.7,16.67 53.34,16.03 R5.1 53.34,15.88 | 52.7,21.59 C10.2 | C3.2 C1.2 52.07,12.06 52.7,12.06 | 52.7,12.06 53.34,12.06 C15.2 | 53.34,15.88 C16.2 53.34,14.61 52.7,13.97 52.7,12.06 | 53.34,15.88 54.61,15.88 R3.1 | 46.83,24.29 48.26,25.72 J6.1 48.26,29.21 51.28,29.21 52.07,28.42 52.07,27.94 53.02,26.99 53.02,23.18 52.7,22.86 | 46.83,24.29 46.67,24.13 | 46.67,24.13 46.67,20.16 47.78,19.05 C8.2 | 46.67,24.13 C13.2 46.83,24.29 | 37.78,8.1 37.78,13.97 C7.2 | 37.78,8.1 37.78,6.83 38.1,6.51 U6.2 | C5.2 C2.2 52.07,1.75 44.61,1.75 44.61,1.91 J10.1 44.45,1.91 42.86,1.91 | 42.86,1.91 41.28,1.91 J12.4 | 42.55,8.25 U8.A1 42.7,8.1 | 42.55,8.25 42.55,10 43.97,11.43 | 35.88,1.91 37.47,1.91 J12.3 | 35.88,1.91 34.92,1.91 J13.4 | 43.81,7.14 46.51,7.14 46.99,7.62 U1.2 47.15,7.62 47.94,8.41 47.94,10.32 49.05,11.43 C19.2 | 43.81,7.14 43.66,7.14 U8.C3 | 35.88,1.91 35.88,4.6 34.13,6.35 | 34.13,6.35 34.13,6.98 34.45,7.3 35.72,7.3 35.72,6.83 37.15,5.4 39.85,5.4 | 42.86,5.4 43.81,5.4 43.81,7.14 | 42.86,5.4 41.12,5.4 | 41.12,5.4 39.85,5.4 | 42.55,8.25 41.12,8.25 41.12,5.4 | 42.86,5.4 42.86,1.91 | 43.97,11.43 42.23,13.18 42.23,16.35 41.91,16.67 U3.2 41.91,21.11 42.39,21.59 R2.2 42.55,21.59 42.55,25.24
  Top 0.152: 43.97,11.43 C20.2 | 37.78,8.1 40,8.1 40,6.83 39.85,6.67 39.85,5.4 | 46.83,24.29 45.88,25.24 42.55,25.24 | 52.7,22.86 R10.1 | 34.13,6.35 v33.81,6.03 | U2.4 7.62,11.77 7.62,6.35 1.27,6.35 1.27,6.55 0.97,6.86 0.97,11.56 2.09,12.68 v2.09,15.24
  Bottom 0.152: v7.94,27.15 4.76,27.15 | 4.76,27.15 v2.06,27.15 | 4.76,27.15 v4.76,26.99 | v17.15,2.7 v20.32,5.87 v23.5,5.87 24.61,5.87 v25.56,6.83 26.35,6.03 v33.81,6.03 | v2.09,15.24 4.07,15.24 v4.76,15.93
INT1  (via drill 0.35)
  Top 0.152: v5.4,25.24 6.35,24.29 6.35,7.62 4.45,7.62 4.29,7.78 4.29,8.25 U4.7
  Bottom 0.152: v5.4,25.24 4.13,26.51 1.75,26.51 1.43,26.83 1.43,30.8 42.86,30.8 J7.1
INT2  (via drill 0.35)
  Top 0.152: v6.67,26.51 6.67,7.3 4.13,7.3 3.65,7.78 3.65,8.1 3.49,8.25 U4.6
  Bottom 0.152: v6.67,26.51 41.75,26.51 J8.1
MISO_ALT  (via drill 0.35)
  Top 0.152: v26.99,19.05 26.67,18.73 26.67,17.46 U5.21 | v28.42,19.37 29.05,20 29.05,25.56 U7.10
  Bottom 0.152: v26.99,19.05 27.31,19.37 v28.42,19.37
MOSI_ALT
  Top 0.152: U5.19 27.78,17.46 27.78,17.94 28.58,18.73 31.75,18.73 31.75,25.56 U7.14
N$1
  Top 0.152: R1.1 C9.2
N$2  (via drill 0.35)
  Top 0.152: U4.14 4.13,12.06 4.13,14.13 3.81,14.45 C9.1 3.81,14.61 3.18,15.24 3.18,23.34 v4.13,24.29 | v52.39,24.77 52.07,24.45 52.07,22.07 51.59,21.59 C10.1
  Bottom 0.152: v52.39,24.77 50.96,26.19 7.3,26.19 5.4,24.29 v4.13,24.29
N$3  (via drill 0.35)
  Top 0.152: v23.65,19.05 23.65,20.32 D1.C | v19.53,19.05 16.19,15.72 16.19,1.59 Q1.E | v20.48,25.56 20.48,30.96 7.46,30.96 SW1.3
  Bottom 0.152: v23.65,19.05 v19.53,19.05 14.76,19.05 14.76,20 15.08,20.32 15.24,20.32 v20.48,25.56
N$4  (via drill 0.35)
  Top 0.152: 53.98,11.43 54.93,12.38 54.93,12.7 Y1.1 | 53.98,11.43 53.34,10.8 C15.1 | v32.54,11.27 31.43,11.27 U5.1 | 53.98,11.43 v54.13,11.43
  Bottom 0.152: v32.54,11.27 32.7,11.43 v54.13,11.43
N$5
  Top 0.152: D2.C 13.97,5.72 12.7,5.72 R4.1
N$6
  Top 0.152: R2.1 41.28,21.59 41.12,21.43 41.12,18.89 U3.5
N$7  (via drill 0.35)
  Top 0.152: v12.07,14.45 12.07,5.24 12.7,4.6 R4.2 | v40.96,17.78 40.96,16.83 U3.1
  Bottom 0.152: v12.07,14.45 14.29,16.67 33.66,16.67 34.77,17.78 v40.96,17.78
N$8  (via drill 0.35)
  Top 0.152: 54.13,13.18 53.34,13.18 C16.1 | v54.13,12.7 54.13,13.18 | v32.39,12.22 31.91,11.75 31.43,11.75 U5.2 | 54.13,13.18 54.18,13.18 54.59,13.58 55.03,13.58 55.42,13.97 56.68,13.97 Y1.2
  Bottom 0.152: v54.13,12.7 53.66,12.22 v32.39,12.22
N$9
  Top 0.152: C14.1 27.94,9.84 28.1,10 28.1,10.48 U5.43
N$10  (via drill 0.35)
  Top 0.152: v43.18,6.35 U8.C2 43.18,7.14 | v52.7,5.72 54.45,7.46 54.45,7.62 L1.2
  Bottom 0.152: v43.18,6.35 43.81,5.72 v52.7,5.72
N$11  (via drill 0.35)
  Top 0.152: v53.66,18.57 53.66,17.46 53.34,17.14 R5.2 | v25.56,20 25.88,20.32 25.88,21.75 26.04,21.91 26.04,23.5 26.83,24.29 26.83,25.56 U7.7
  Bottom 0.152: v53.66,18.57 52.23,20 v25.56,20
N$12  (via drill 0.35)
  Top 0.152: v18.41,7.46 18.41,6.98 19.05,6.35 C21.1 | v35.08,17.14 36.67,18.73 36.67,25.56 U7.21
  Bottom 0.152: v18.41,7.46 16.19,9.68 4.45,9.68 4.13,10 4.13,13.18 31.11,13.18 v35.08,17.14
N$13
  Top 0.152: 43.66,8.1 U8.A3 43.81,8.25 43.81,8.73 44.45,9.37 R6.1
RESET  (via drill 0.35)
  Top 0.152: 49.53,15.88 49.53,14.45 49.05,13.97 R9.1 | v26.35,9.21 26.67,9.53 26.67,10.48 U5.40 | v45.72,10.64 46.04,10.95 46.04,12.38 49.53,15.88 | 49.53,15.88 D3.A
  Bottom 0.152: v26.35,9.21 26.35,10.64 v45.72,10.64
RX_LED/IO25/AIN11
  Top 0.152: 31.75,6.98 31.75,4.45 31.27,3.97 31.27,3.33 J13.1 | 31.75,6.98 31.75,9.53 30.8,10.48 U5.48 | 31.75,6.98 34.61,4.13 34.61,3.49 34.77,3.33 J13.2
SCK_ALT  (via drill 0.35)
  Top 0.152: v27.78,22.38 27.78,18.89 27.31,18.42 27.31,17.46 U5.20 | v29.84,23.02 31.11,24.29 31.11,25.56 U7.13
  Bottom 0.152: v27.78,22.38 28.42,23.02 v29.84,23.02
SCL_3V3
  Top 0.152: U2.2 10.32,11.91 10.32,23.81 6.51,27.62 2.7,27.62 2.7,12.86 1.27,11.43 1.27,10.8 1.43,10.64 1.91,10.64 U4.2
SDA_3V3
  Top 0.152: U2.3 10,11.91 10,12.22 9.84,12.38 6.98,12.38 6.98,7.14 6.83,6.98 1.27,6.98 1.27,9.53 1.43,9.68 1.91,9.68 U4.3
TX_LED/IO26  (via drill 0.35)
  Top 0.152: v25.72,7.94 25.72,9.53 26.19,10 26.19,10.48 U5.39 | v32.39,7.94 33.18,8.73 v33.18,20.95 | v28.42,23.65 28.42,25.56 U7.9
  Bottom 0.152: v32.39,7.94 v25.72,7.94 | v33.18,20.95 30.48,23.65 v28.42,23.65
USB_HOST_EN/IO27  (via drill 0.35)
  Top 0.152: v43.18,9.53 U8.A2 43.18,8.1 | v27.31,9.53 27.31,10.48 U5.41
  Bottom 0.152: v43.18,9.53 42.55,10.16 27.94,10.16 v27.31,9.53
USB_N
  Top 0.152: U5.33 24.45,12.7 23.97,12.7 23.81,12.86 23.02,12.86 23.02,12.7 22.38,12.06 22.38,10.64 22.07,10.32 20.16,10.32 20.16,21.59 16.03,25.72 16.03,26.51 J11.2
USB_P  (via drill 0.35)
  Top 0.152: v23.5,12.22 24.45,12.22 U5.34 | v14.13,12.54 14.45,12.86 14.45,25.08 15.24,25.88 J11.3
  Bottom 0.152: v23.5,12.22 23.18,12.54 v14.13,12.54
V_FB
  Top 0.152: 43.66,7.62 U8.B3 44.45,7.62 R6.2 44.45,8.41 45.09,9.05 45.09,13.81 49.21,17.94 49.21,28.89 51.12,28.89 51.75,28.26 51.75,23.02 51.59,22.86 R10.2
VBATT  (via drill 0.35)
  Top 0.152: 44.13,18.1 44.77,18.73 44.77,24.13 C13.1 | 44.13,18.1 42.86,16.83 U3.3 | v15.88,17.3 15.88,4.29 Q1.C | 44.13,18.1 v43.81,18.42 | v50.64,8.25 50.64,6.03 47.47,6.03 44.61,3.17 J10.2
  Bottom 0.152: v15.88,17.3 16.67,18.1 40.32,18.1 40.64,18.42 v43.81,18.42 44.93,17.3 54.77,17.3 54.77,11.11 54.45,10.8 53.18,10.8 v50.64,8.25
VCC  (via drill 0.35)
  Top 0.152: 51.44,19.05 51.44,20.32 C18.1 | 52.07,13.97 R7.2 52.07,14.76 52.7,15.4 52.7,16.19 52.39,16.51 52.39,18.1 51.44,19.05 | 52.07,13.97 C1.1 | 52.07,13.97 50.32,13.97 | 50.32,13.97 50.17,13.97 | 49.69,10.16 50.17,10.64 50.17,12.54 | 49.69,10.16 48.74,9.21 48.74,6.83 47.15,6.83 U1.3 | 50.17,13.97 50.17,12.54 | 46.36,9.21 46.99,8.57 U1.1 | 46.36,9.21 46.36,12.22 46.67,12.54 50.17,12.54 | 50.32,13.97 50.32,16.99 49.53,16.99 D3.C | 50.17,13.97 R9.2 | 51.44,19.05 C17.1 | 53.82,9.84 53.5,10.16 49.69,10.16 | 53.82,9.84 55.4,8.25 55.4,3.97 C5.1 | 55.72,27.78 J3.1 55.88,15.2 57.31,13.77 57.31,11.95 57.17,11.82 55.8,11.82 55.64,11.67 | 53.82,9.84 55.64,11.67 | 55.64,11.67 55.72,11.75 | 36.04,10 37.15,8.89 U6.5 | 36.04,10 36.04,13.97 C7.1 35.88,13.97 34.45,15.4 34.45,20.64 33.5,21.59 32.23,21.59 32.23,18.26 | 32.23,18.26 29.05,18.26 28.73,17.94 28.73,17.46 U5.17 | 32.23,18.26 32.23,14.13 31.91,13.81 31.43,13.81 U5.6 | 31.11,6.35 31.11,6.19 30,5.08 C12.1 | 21.11,13.97 23.02,15.88 23.02,23.18 24.13,24.29 24.13,25.56 U7.3 24.29,25.56 24.77,25.56 U7.4 | v24.13,10.48 24.13,10.8 24.45,11.11 U5.36 | v21.75,10.95 21.11,11.59 21.11,13.97 | 21.11,13.97 R8.2 | v28.58,9.53 28.58,10.48 U5.44 | 31.11,6.35 30.8,6.67 v30.8,8.57 | 31.11,6.35 C11.1 | v35.24,9.21 36.04,10 | v45.72,9.21 46.36,9.21 | U2.8 10.71,11.09 11.43,11.81 11.43,15.24 v13.84,15.24 | v20.77,15.24 21.11,15.24 21.11,13.97
  Bottom 0.152: v21.75,10.95 23.65,10.95 v24.13,10.48 26.04,8.57 27.62,8.57 v28.58,9.53 29.84,9.53 v30.8,8.57 34.61,8.57 34.92,8.89 | 34.92,8.89 v35.24,9.21 | v45.72,9.21 45.4,8.89 34.92,8.89 | v13.84,15.24 v20.77,15.24
VCC_3V3  (via drill 0.35)
  Top 0.152: 51.28,9.37 49.53,9.37 49.53,8.57 U1.5 | 51.28,9.37 52.07,9.37 C3.1 | 51.28,9.37 51.28,5.08 | 51.28,5.08 51.28,4.29 C2.1 | 2.86,11.11 2.86,11.91 U4.16 2.86,12.06 3.33,12.06 U4.15 | 2.86,11.11 2.86,10.32 | 2.86,10.32 2.86,8.41 U4.5 | 2.86,11.11 2.06,11.11 U4.1 | 17.78,10.32 17.78,12.54 18.41,13.18 19.84,13.18 19.84,11.43 19.05,10.64 | 17.78,10.32 17.78,5.56 18.26,5.08 C4.1 | v4.76,10.32 2.86,10.32 | 17.78,10.32 v17.62,10.32 | v49.69,5.08 51.28,5.08 | v22.7,5.24 22.7,6.98 19.05,10.64 | 19.05,10.64 C6.1 | v11.43,15.85 11.43,15.67 11.12,15.37 11.12,12.2 U2.1 | U2.5 9.36,11.09 v9.36,10.32
  Bottom 0.152: v4.76,10.32 v9.36,10.32 v17.62,10.32 17.02,9.72 19.02,7.71 19.02,7.21 18.67,6.85 6.37,6.85 3.51,9.72 3.51,13.94 4.62,15.05 10.64,15.05 v11.43,15.85 | v49.69,5.08 49.53,5.24 v22.7,5.24
VCC_IN  (via drill 0.35)
  Top 0.152: v41.75,7.62 U8.B1 42.7,7.62 | v39.37,7.46 39.05,7.14 39.05,6.51 U6.3 38.89,6.35 38.73,6.19 38.73,6.03 38.42,5.72 37.31,5.72 37.31,6.35 U6.1 37.15,6.35 34.13,9.37 34.13,18.42 v33.81,18.73 | v51.91,6.35 51.91,7.46 52.07,7.62 L1.1 | v47.31,9.53 C19.1 | v3.81,21.91 C22.1 | SW1.2 4.25,30.96 3.27,31.94 1.84,31.94 0.7,30.81 0.7,27.61 1.27,27.05 v1.27,22.86
  Bottom 0.152: v39.37,7.46 41.59,7.46 v41.75,7.62 47.31,7.62 | v51.91,6.35 50.64,7.62 47.31,7.62 | 47.31,7.62 v47.31,9.53 | v33.81,18.73 33.5,18.42 7.3,18.42 v3.81,21.91 1.27,21.91 v1.27,22.86
(copper drawn outside any net)
  shapes: Top area x2